# EAGLE design Autosense-combined (EAGLE 6.5.0)
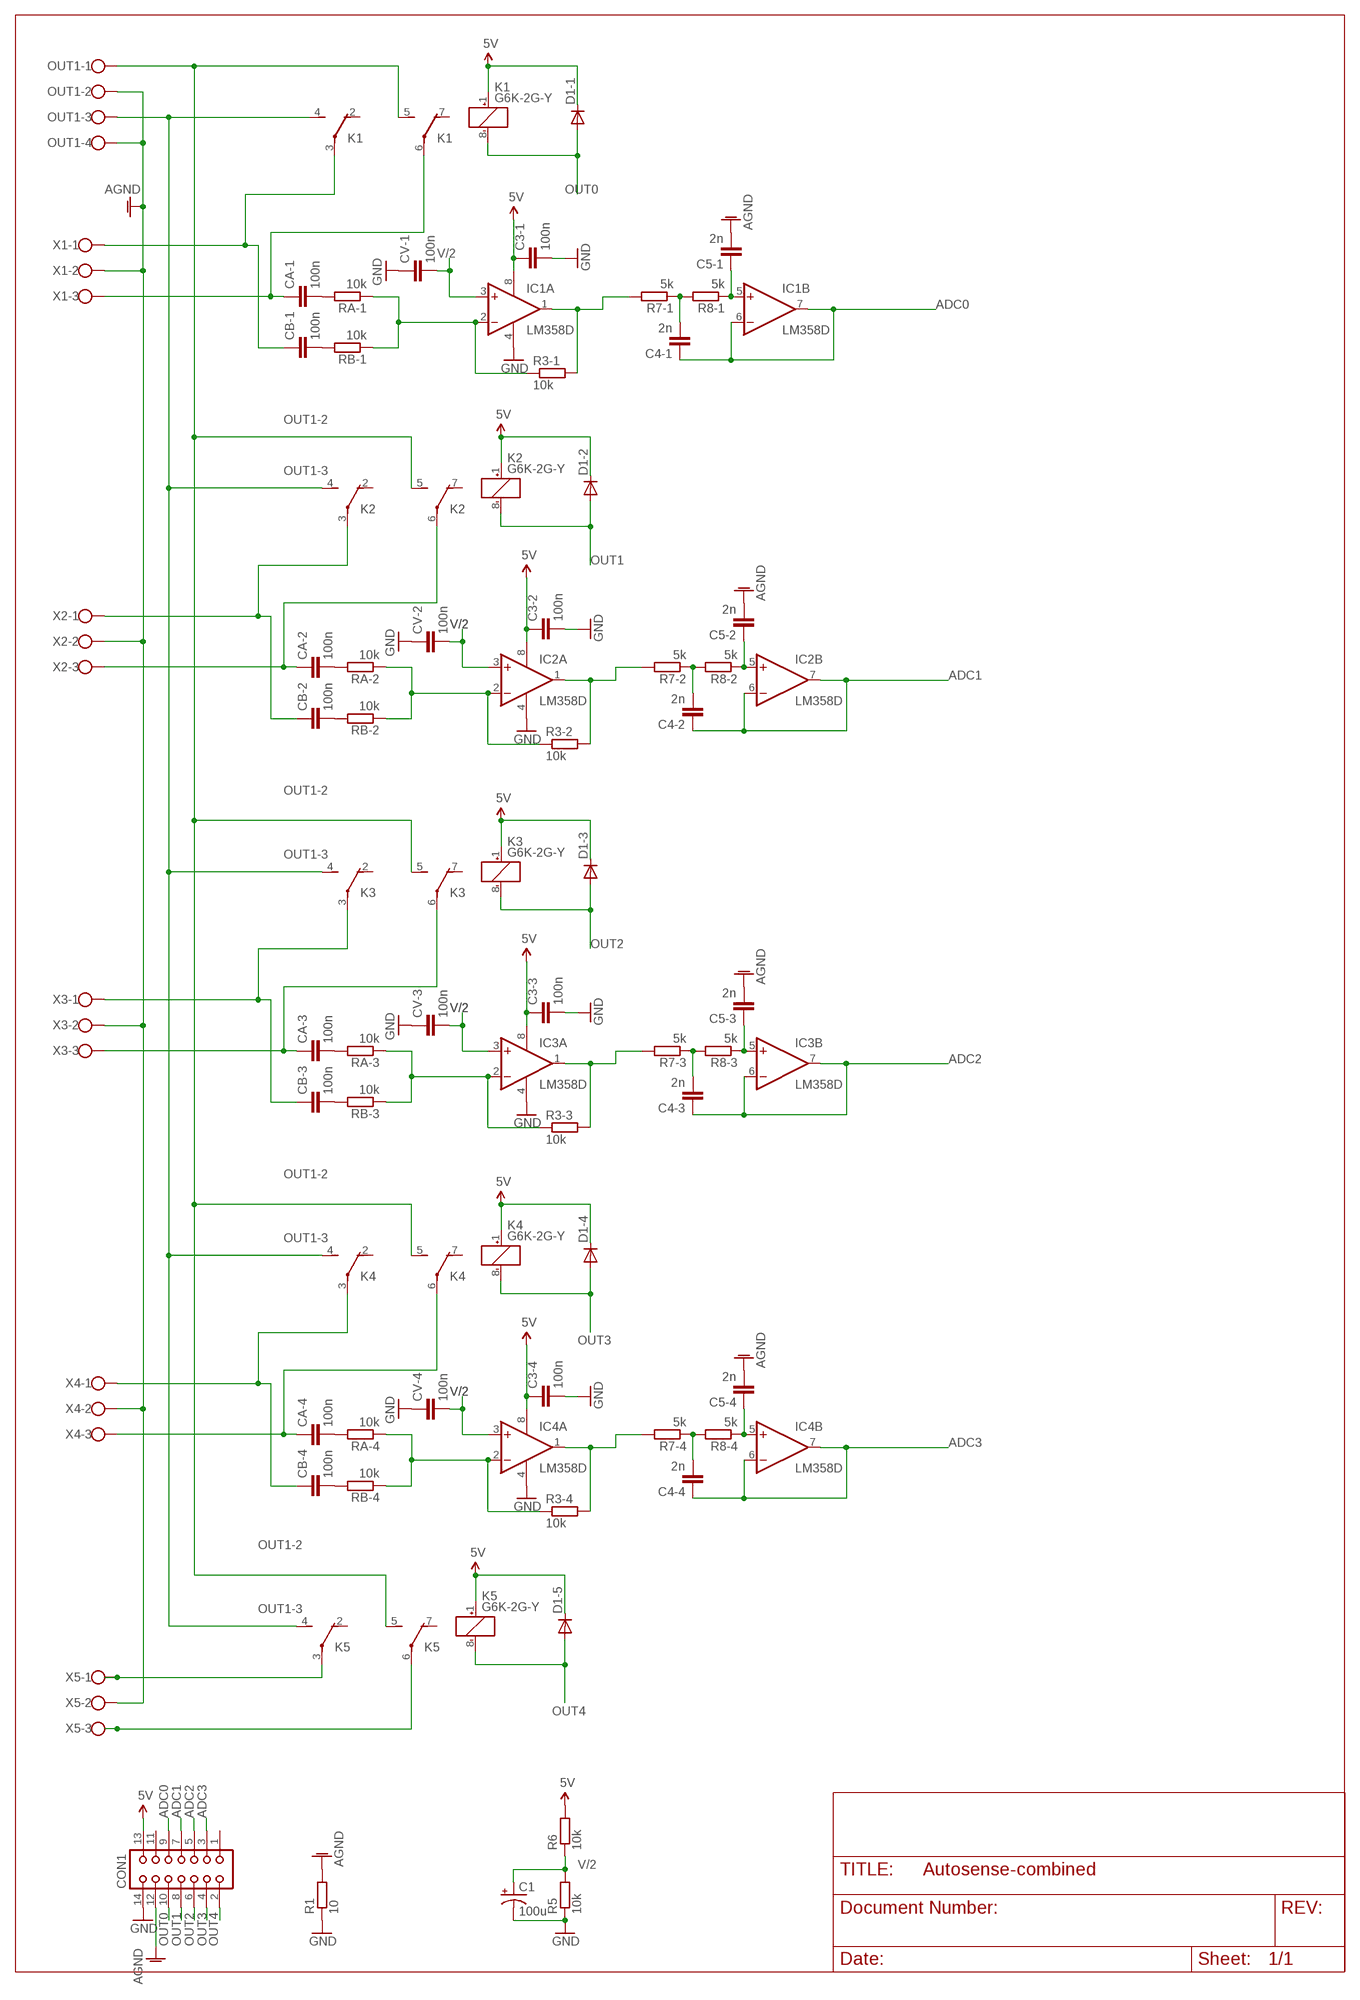
[diagram p0: schematic, sheet 1]

## Parts
C1  100u  CAP_POLPTH1  [CPOL-RADIAL-100UF-25V]
C3-1  100n  C-EUC0805  [C0805]
C3-2  100n  C-EUC0805  [C0805]
C3-3  100n  C-EUC0805  [C0805]
C3-4  100n  C-EUC0805  [C0805]
C4-1  2n  C-EUC0805  [C0805]
C4-2  2n  C-EUC0805  [C0805]
C4-3  2n  C-EUC0805  [C0805]
C4-4  2n  C-EUC0805  [C0805]
C5-1  2n  C-EUC0805  [C0805]
C5-2  2n  C-EUC0805  [C0805]
C5-3  2n  C-EUC0805  [C0805]
C5-4  2n  C-EUC0805  [C0805]
CA-1  100n  C-EUC0805  [C0805]
CA-2  100n  C-EUC0805  [C0805]
CA-3  100n  C-EUC0805  [C0805]
CA-4  100n  C-EUC0805  [C0805]
CB-1  100n  C-EUC0805  [C0805]
CB-2  100n  C-EUC0805  [C0805]
CB-3  100n  C-EUC0805  [C0805]
CB-4  100n  C-EUC0805  [C0805]
CON1  CON14L  [CON14L]
CV-1  100n  C-EUC0805  [C0805]
CV-2  100n  C-EUC0805  [C0805]
CV-3  100n  C-EUC0805  [C0805]
CV-4  100n  C-EUC0805  [C0805]
D1-1  DIODE-GF1  [GF1]
D1-2  DIODE-GF1  [GF1]
D1-3  DIODE-GF1  [GF1]
D1-4  DIODE-GF1  [GF1]
D1-5  DIODE-GF1  [GF1]
IC1  LM358D  [SO08]
IC2  LM358D  [SO08]
IC3  LM358D  [SO08]
IC4  LM358D  [SO08]
K1  G6K-2G-Y  [G6K-2G-Y]
K2  G6K-2G-Y  [G6K-2G-Y]
K3  G6K-2G-Y  [G6K-2G-Y]
K4  G6K-2G-Y  [G6K-2G-Y]
K5  G6K-2G-Y  [G6K-2G-Y]
OUT1  W237-4  [W237-4]
R1  10  R-EU_R1206  [R1206]
R3-1  10k  R-EU_R0805  [R0805]
R3-2  10k  R-EU_R0805  [R0805]
R3-3  10k  R-EU_R0805  [R0805]
R3-4  10k  R-EU_R0805  [R0805]
R5  10k  R-EU_R0805  [R0805]
R6  10k  R-EU_R0805  [R0805]
R7-1  5k  R-EU_R0805  [R0805]
R7-2  5k  R-EU_R0805  [R0805]
R7-3  5k  R-EU_R0805  [R0805]
R7-4  5k  R-EU_R0805  [R0805]
R8-1  5k  R-EU_R0805  [R0805]
R8-2  5k  R-EU_R0805  [R0805]
R8-3  5k  R-EU_R0805  [R0805]
R8-4  5k  R-EU_R0805  [R0805]
RA-1  10k  R-EU_R0805  [R0805]
RA-2  10k  R-EU_R0805  [R0805]
RA-3  10k  R-EU_R0805  [R0805]
RA-4  10k  R-EU_R0805  [R0805]
RB-1  10k  R-EU_M0805  [M0805]
RB-2  10k  R-EU_M0805  [M0805]
RB-3  10k  R-EU_M0805  [M0805]
RB-4  10k  R-EU_M0805  [M0805]
X1  W237-103  [W237-103]
X2  W237-103  [W237-103]
X3  W237-103  [W237-103]
X4  W237-103  [W237-103]
X5  W237-103  [W237-103]

## Nets
5V: C3-1.1 C3-2.1 C3-3.1 C3-4.1 CON1.13 D1-1.C D1-2.C D1-3.C D1-4.C D1-5.C IC1.8(P:V+) IC2.8(P:V+) IC3.8(P:V+) IC4.8(P:V+) K1.1(1:+) K2.1(1:+) K3.1(1:+) K4.1(1:+) K5.1(1:+) R6.2
$NET1: CB-2.1 K2.3(2:P) X2.1
$NET2: CB-3.1 K3.3(2:P) X3.1
$NET3: CB-4.1 K4.3(2:P) X4.1
$NET4: K5.3(2:P) X5.1
$NET13: CB-1.1 K1.3(2:P) X1.1
ADC0: C4-1.1 CON1.9 IC1.6(B:-IN) IC1.7(B:OUT)
ADC1: C4-2.1 CON1.7 IC2.6(B:-IN) IC2.7(B:OUT)
ADC2: C4-3.1 CON1.5 IC3.6(B:-IN) IC3.7(B:OUT)
ADC3: C4-4.1 CON1.3 IC4.6(B:-IN) IC4.7(B:OUT)
AGND: C5-1.2 C5-2.2 C5-3.2 C5-4.2 CON1.12 OUT1.2 OUT1.4 R1.2 X1.2 X2.2 X3.2 X4.2 X5.2
GND: C1.2(-) C3-1.2 C3-2.2 C3-3.2 C3-4.2 CON1.14 CV-1.1 CV-2.1 CV-3.1 CV-4.1 IC1.4(P:V-) IC2.4(P:V-) IC3.4(P:V-) IC4.4(P:V-) R1.1 R5.1
N$1: CA-1.1 K1.6(3:P) X1.3
N$2: C5-1.1 IC1.5(B:+IN) R8-1.1
N$3: IC3.1(A:OUT) R3-3.2 R7-3.2
N$4: IC3.2(A:-IN) R3-3.1 RA-3.1 RB-3.1
N$5: C5-3.1 IC3.5(B:+IN) R8-3.1
N$6: IC1.2(A:-IN) R3-1.1 RA-1.1 RB-1.1
N$7: IC2.1(A:OUT) R3-2.2 R7-2.2
N$8: C4-1.2 R7-1.1 R8-1.2
N$9: IC1.1(A:OUT) R3-1.2 R7-1.2
N$10: IC2.2(A:-IN) R3-2.1 RA-2.1 RB-2.1
N$11: CA-1.2 RA-1.2
N$12: C5-2.1 IC2.5(B:+IN) R8-2.1
N$13: CB-1.2 RB-1.2
N$14: C4-2.2 R7-2.1 R8-2.2
N$15: C4-3.2 R7-3.1 R8-3.2
N$16: CA-3.2 RA-3.2
N$17: CA-2.2 RA-2.2
N$18: CB-2.2 RB-2.2
N$19: CA-2.1 K2.6(3:P) X2.3
N$20: CB-3.2 RB-3.2
N$21: CA-3.1 K3.6(3:P) X3.3
N$22: IC4.1(A:OUT) R3-4.2 R7-4.2
N$23: IC4.2(A:-IN) R3-4.1 RA-4.1 RB-4.1
N$24: C5-4.1 IC4.5(B:+IN) R8-4.1
N$25: C4-4.2 R7-4.1 R8-4.2
N$26: CA-4.2 RA-4.2
N$27: CB-4.2 RB-4.2
N$28: CA-4.1 K4.6(3:P) X4.3
N$29: K5.6(3:P) X5.3
OUT0: CON1.10 D1-1.A K1.8(1:-)
OUT1: CON1.8 D1-2.A K2.8(1:-)
OUT1-2: K1.5(3:S) K2.5(3:S) K3.5(3:S) K4.5(3:S) K5.5(3:S) OUT1.1
OUT1-3: K1.4(2:S) K2.4(2:S) K3.4(2:S) K4.4(2:S) K5.4(2:S) OUT1.3
OUT2: CON1.6 D1-3.A K3.8(1:-)
OUT3: CON1.4 D1-4.A K4.8(1:-)
OUT4: CON1.2 D1-5.A K5.8(1:-)
V/2: C1.1(+) CV-1.2 CV-2.2 CV-3.2 CV-4.2 IC1.3(A:+IN) IC2.3(A:+IN) IC3.3(A:+IN) IC4.3(A:+IN) R5.2 R6.1
Unconnected: CON1.1 CON1.11 K1.2(2:O) K1.7(3:O) K2.2(2:O) K2.7(3:O) K3.2(2:O) K3.7(3:O) K4.2(2:O) K4.7(3:O) K5.2(2:O) K5.7(3:O)

## Library data of the parts
C1 = SparkFun:CAP_POL: Capacitor Polarized These are standard SMD and PTH capacitors. Normally 10uF, 47uF, and 100uF in electrolytic and tantalum varieties. Always verify the external diameter of the through hole cap, it varies with capacity, voltage, and manufacturer. The EIA devices should be standard.
C3-1-C3-4 C4-1-C4-4 C5-1-C5-4 CA-1-CA-4 CB-1-CB-4 CV-1-CV-4 = rcl:C-EU: CAPACITOR, European symbol
CON1 = con-harting-lars:CON14L: CONNECTOR; OC_FARNELL: unknown; OC_NEWARK: unknown
D1-1-D1-5 = diode:DIODE-: DIODE
IC1-IC4 = linear:LM358: OP AMP also LM158; LM258; LM2904 Source: http://cache.national.com/ds/LM/LM158.pdf
K1-K5 = relay:G6K: Low Signal Relay oeiwcsnts1.omron.com/.. D20G6K0100.pdf; OC_FARNELL: 4484794; OC_NEWARK: unknown
OUT1 = con-wago-500:W237-4: WAGO SCREW CLAMP; OC_FARNELL: unknown; OC_NEWARK: unknown
R1 RB-1-RB-4 = rcl:R-EU_: RESISTOR, European symbol
R3-1-R3-4 R5 R6 R7-1-R7-4 R8-1-R8-4 RA-1-RA-4 = resistor:R-EU_: RESISTOR, European symbol
X1-X5 = con-wago-500:W237-103: WAGO SCREW CLAMP; MPN: 237-103; OC_FARNELL: unknown; OC_NEWARK: 18M7116

## Board
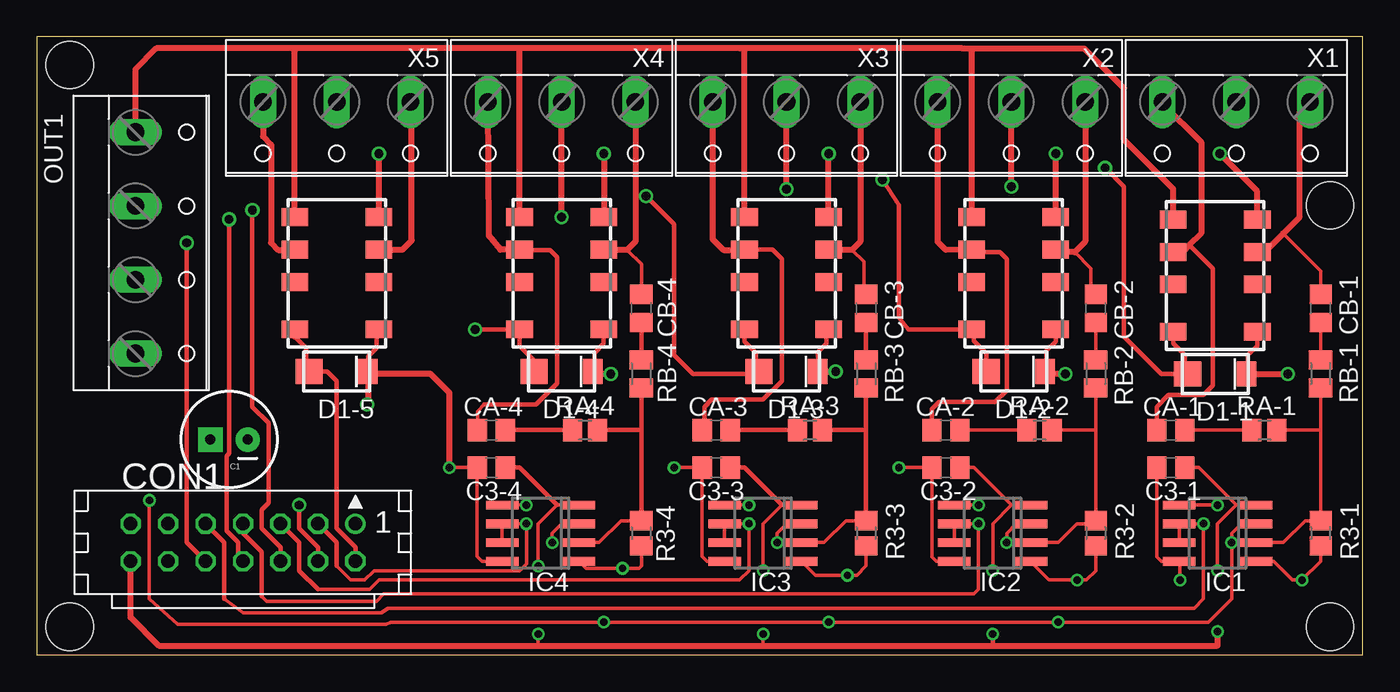
[diagram p1: board, top side]
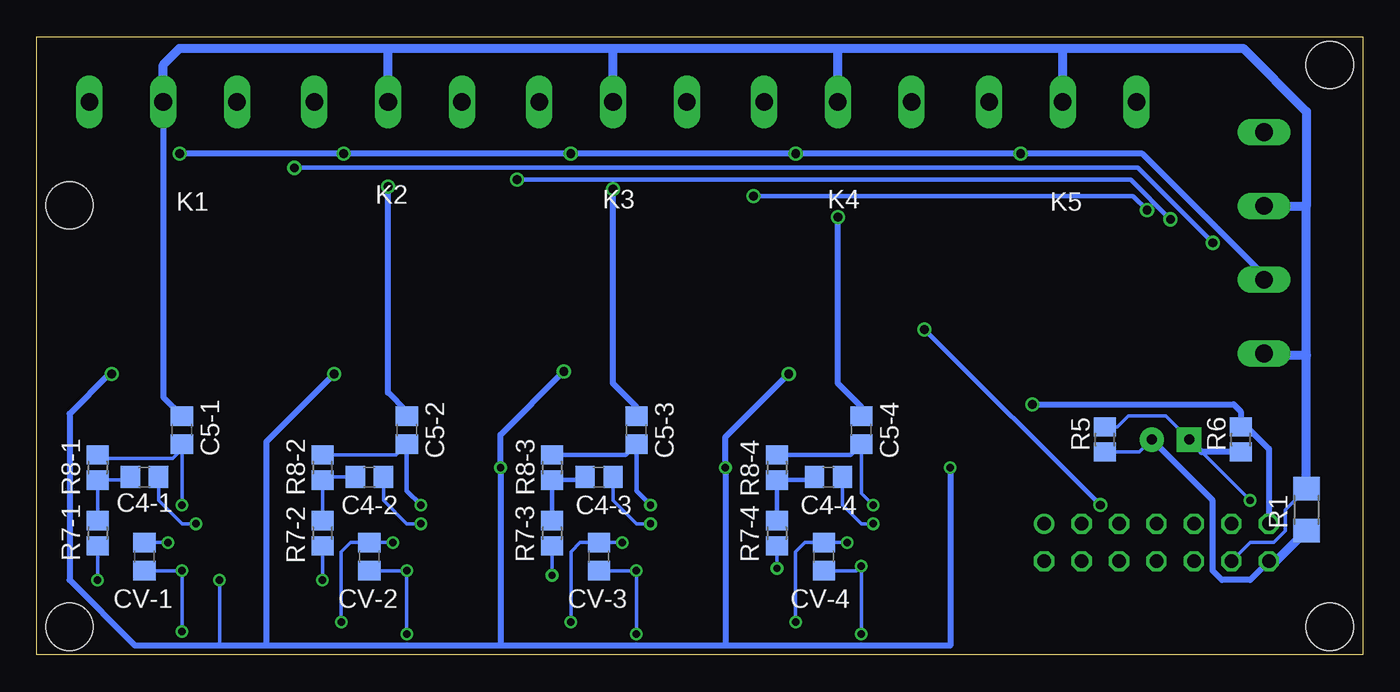
[diagram p2: board, bottom side, seen from below]

Size 89.84 x 41.9 mm. Coordinates in mm from the lower left corner, seen from the top.
Outline: 0,0 89.84,0 89.84,41.9 0,41.9 0,0
Copper layers (1*16): Top 0.0356mm / dielectric 1.5011mm / Bottom 0.0356mm
Design rules "LaenPCBOrder": minimum track width 6mil, minimum drill 13mil, track to track 6mil, track to pad 6mil, pad to pad 6mil, via to via 6mil, smd to smd 6mil, copper to edge 15mil, drill to drill 6mil, minimum pad ring 7mil, minimum via ring 7mil, stop-mask expansion 4mil, vias tented up to drill 0mil, thermal gap 10mil
Holes 3.2 mm at 87.63,30.48 2.22,1.91 87.63,1.91 2.22,40.01

### Footprints (pad centres in the part's own frame; a part is rotated, then mirrored left to right if it is on the bottom)
CPOL-RADIAL-100UF-25V = drill 0.7 pad 1.651 square: 1 1.27,0 | drill 0.7 pad 1.651: 2 -1.27,0
C0805 = smd 1.3 x 1.5: 1 -0.95,0; 2 0.95,0
CON14L = drill 0.914: 1 7.62,1.27 | drill 0.914 octagon: 2 7.62,-1.27; 3 5.08,1.27; 4 5.08,-1.27; 5 2.54,1.27; 6 2.54,-1.27; 7 0,1.27; 8 0,-1.27; 9 -2.54,1.27; 10 -2.54,-1.27; 11 -5.08,1.27; 12 -5.08,-1.27; 13 -7.62,1.27; 14 -7.62,-1.27
GF1 = smd 1.85 x 1.68: A 1.87,0 | smd 1.32 x 1.68: C -2.12,0
SO08 = smd 0.6 x 2.2: 1 -1.905,-2.6; 2 -0.635,-2.6; 3 0.635,-2.6; 4 1.905,-2.6; 5 1.905,2.6; 6 0.635,2.6; 7 -0.635,2.6; 8 -1.905,2.6
G6K-2G-Y = smd 1.2 x 1.8: 1 -3.8,-2.85; 2 -0.6,-2.85; 3 1.6,-2.85; 4 3.8,-2.85; 5 3.8,2.85; 6 1.6,2.85; 7 -0.6,2.85; 8 -3.8,2.85
W237-4 = drill 1.194 long: 1 -7.5,-1.27; 2 -2.5,-1.27; 3 2.5,-1.27; 4 7.5,-1.27
R1206 = smd 1.6 x 1.803: 1 -1.422,0; 2 1.422,0
R0805 = smd 1.3 x 1.5: 1 -0.85,0; 2 0.85,0
M0805 = smd 1.3 x 1.6: 1 -0.95,0; 2 0.95,0
W237-103 = drill 1.194 long: 1 -5,-1.29; 2 0,-1.29; 3 5,-1.29

### Placement (x,y rotation side)
C1  13.02,14.61 180 top
C3-1  76.83,12.7 0 top
C3-2  61.59,12.7 0 top
C3-3  46.04,12.7 0 top
C3-4  30.8,12.7 0 top
C4-1  82.55,12.06 180 bottom
C4-2  67.31,12.06 180 bottom
C4-3  51.75,12.06 180 bottom
C4-4  36.2,12.06 180 bottom
C5-1  80.01,15.24 90 bottom
C5-2  64.77,15.24 90 bottom
C5-3  49.21,15.24 90 bottom
C5-4  33.97,15.24 90 bottom
CA-1  76.83,15.24 0 top
CA-2  61.59,15.24 0 top
CA-3  46.04,15.24 0 top
CA-4  30.8,15.24 0 top
CB-1  87,23.5 270 top
CB-2  71.75,23.5 270 top
CB-3  56.2,23.5 270 top
CB-4  40.96,23.5 270 top
CON1  13.97,7.62 0 top
CV-1  82.55,6.67 90 bottom
CV-2  67.31,6.67 90 bottom
CV-3  51.75,6.67 90 bottom
CV-4  36.51,6.67 90 bottom
D1-1  79.85,19.05 180 top
D1-2  66.2,19.21 180 top
D1-3  50.8,19.21 180 top
D1-4  35.56,19.21 180 top
D1-5  20.32,19.21 180 top
IC1  80.01,8.26 90 top
IC2  64.77,8.26 90 top
IC3  49.21,8.26 90 top
IC4  34.13,8.26 90 top
K1  79.85,25.72 90 top
K2  66.2,25.88 90 top
K3  50.8,25.88 90 top
K4  35.56,25.88 90 top
K5  20.32,25.88 90 top
OUT1  7.94,27.94 270 top
R1  3.81,9.84 90 bottom
R3-1  87,8.26 270 top
R3-2  71.75,8.26 270 top
R3-3  56.2,8.26 270 top
R3-4  40.96,8.26 270 top
R5  17.46,14.61 90 bottom
R6  8.26,14.61 90 bottom
R7-1  85.72,8.26 270 bottom
R7-2  70.48,8.26 270 bottom
R7-3  54.93,8.26 270 bottom
R7-4  39.69,8.26 270 bottom
R8-1  85.72,12.7 270 bottom
R8-2  70.48,12.7 270 bottom
R8-3  54.93,12.7 270 bottom
R8-4  39.69,12.7 270 bottom
RA-1  83.19,15.24 180 top
RA-2  67.94,15.24 180 top
RA-3  52.39,15.24 180 top
RA-4  37.15,15.24 180 top
RB-1  87,19.05 90 top
RB-2  71.75,19.05 90 top
RB-3  56.2,19.05 90 top
RB-4  40.96,19.05 90 top
X1  81.28,36.2 180 top
X2  66.04,36.2 180 top
X3  50.8,36.2 180 top
X4  35.56,36.2 180 top
X5  20.32,36.2 180 top

### Tracks (layer width: path | path; a pad name or v marks a point on that pad's centre or on a via)
5V  (via drill 0.5, 0.6)
  Top 0.254: v77.47,5.08 77.47,6.29 IC1.8 76.2,6.35 75.89,6.67 C3-1.1 | C3-3.1 45.09,6.67 45.4,6.35 IC3.8 | C3-4.1 29.84,6.67 30.16,6.35 IC4.8 | C3-3.1 v43.18,12.7 | v58.42,12.7 C3-2.1 60.65,6.67 60.96,6.35 IC2.8 | C3-4.1 v27.94,12.7
  Top 0.305: C3-3.1 | C3-4.1 | K1.1 82.7,20.95 82.07,20.32 82.07,19.15 D1-1.C | K2.1 69.05,21.27 68.42,20.64 68.42,19.31 D1-2.C | D1-3.C 52.92,20.54 53.5,21.11 53.5,21.93 K3.1 | K4.1 38.41,21.11 37.78,20.48 37.78,19.31 D1-4.C | D1-5.C 22.44,20.22 23.02,20.8 23.02,21.93
  Top 0.406: v27.94,12.7 27.94,17.78 26.67,19.05 22.6,19.05 D1-5.C 22.44,17.04 v22.38,16.99 | D1-1.C v84.77,19.05 | 23.02,21.93 K5.1 | v38.89,19.05 37.84,19.05 D1-4.C | D1-3.C v54.13,19.21 | 68.38,19.15 D1-2.C 68.48,19.05 v69.69,19.05
  Bottom 0.254: v77.47,5.08 77.47,0.64
  Bottom 0.406: 43.18,0.64 27.94,0.64 v27.94,12.7 | 43.18,0.64 58.42,0.64 | 58.42,0.64 74.3,0.64 | 74.3,0.64 77.47,0.64 83.19,0.64 87.63,5.08 87.63,16.35 84.93,19.05 v84.77,19.05 | 74.3,0.64 74.3,14.45 v69.69,19.05 | 58.42,0.64 v58.42,12.7 58.42,14.92 v54.13,19.21 | 43.18,0.64 v43.18,12.7 43.18,14.76 v38.89,19.05 | CON1.13 6.35,13.97 7.83,15.46 R6.2 8.26,16.51 8.73,16.99 v22.38,16.99
$NET1
  Top 0.254: CB-2.1 71.44,24.77 71.44,26.2 70.33,27.3
  Top 0.406: X2.1 71.04,28.02 70.33,27.3 68.58,27.3 K2.3
$NET2
  Top 0.254: CB-3.1 56.05,24.45 56.05,26.66 55.24,27.46
  Top 0.406: X3.1 55.8,28.02 55.24,27.46 53.66,27.46 K3.3
$NET3
  Top 0.254: CB-4.1 40.96,26.51 40.01,27.46
  Top 0.406: X4.1 40.56,28.02 40.01,27.46 38.26,27.46 K4.3
$NET4
  Top 0.406: K5.3 24.78,27.48 25.4,28.1 25.4,37.41 X5.1
$NET13
  Top 0.254: CB-1.1 87,26.04 84.45,28.57
  Top 0.406: X1.1 85.57,36.77 85.57,29.69 84.45,28.57 83.2,27.32 K1.3
  Bottom 0.254: X1.1 86.28,37.38
ADC0  (via drill 0.5)
  Top 0.254: 12.7,3.81 13.97,2.86 23.34,2.86 23.81,3.17 78.42,3.17 79.06,3.81 v79.06,8.89 IC1.6 IC1.7
  Top 0.305: 12.7,3.81 12.7,7.62 CON1.9
  Bottom 0.254: C4-1.1 81.6,10.48 80.01,8.89 v79.06,8.89
ADC1  (via drill 0.5)
  Top 0.254: 15.24,3.97 15.56,3.65 23.02,3.65 23.5,4.13 63.5,4.13 63.82,4.45 v63.82,8.89 IC2.6 IC2.7
  Top 0.305: CON1.7 13.97,8.26 15.24,6.99 15.24,3.97
  Bottom 0.254: C4-2.1 66.36,10.48 64.77,8.89 v63.82,8.89
ADC2  (via drill 0.5)
  Top 0.254: 19.05,4.45 22.54,4.45 23.18,5.08 47.62,5.08 48.26,5.71 v48.26,8.89 IC3.6 IC3.7
  Top 0.305: 19.05,4.45 17.78,5.71 17.78,7.62 CON1.5
  Bottom 0.254: 50.8,11.43 50.8,10.48 49.21,8.89 v48.26,8.89
  Bottom 0.305: C4-3.1 50.8,11.43
ADC3  (via drill 0.5)
  Top 0.254: 20.32,6.03 21.27,5.08 22.23,5.08 22.86,5.71 32.7,5.71 33.18,6.19 v33.18,8.89 IC4.6 IC4.7
  Top 0.305: 20.32,6.03 20.32,7.62 CON1.3
  Bottom 0.254: C4-4.1 35.24,10.16 33.97,8.89 v33.18,8.89
AGND  (via drill 0.6)
  Top 0.406: v66.04,31.75 X2.2 | v50.8,31.59 X3.2 | v35.56,29.69 X4.2
  Bottom 0.254: CON1.12 7.62,7.62 6.03,7.62 5.24,8.41 5.24,9.84 R1.2 | C5-4.2 34.29,16.51
  Bottom 0.406: C5-2.2 64.77,16.51 66.04,17.78 v66.04,31.75 | v35.56,29.69 35.56,18.41 33.97,16.83 C5-4.2 | X1.2 81.28,17.46 C5-1.2 | C5-3.2 49.21,16.83 50.8,18.41 v50.8,31.59
  Bottom 0.61: X1.2 81.28,40.01 80.17,41.12 66.04,41.12 | X2.2 66.04,41.12 | 3.81,30.48 3.81,36.83 8.1,41.12 20.32,41.12 | OUT1.4 6.55,20.32 3.81,20.32 | OUT1.2 3.85,30.44 3.81,30.48 | 66.04,41.12 50.8,41.12 | 50.8,41.12 35.56,41.12 | 35.56,41.12 20.32,41.12 | X4.2 35.56,41.12 | X3.2 50.8,41.12 | R1.2 3.81,20.32 | 3.81,20.32 3.81,30.48 | X5.2 20.32,41.12
GND  (via drill 0.5)
  Top 0.254: 81.28,10.16 78.74,12.7 C3-1.2 | 81.28,10.16 80.01,8.89 v80.01,5.71 | C3-2.2 63.5,12.7 66.04,10.16 | 66.04,10.16 64.77,8.89 v64.77,5.71 | v49.21,5.71 49.21,8.89 50.48,10.16 IC3.4 | v49.21,1.43 49.21,0.64 | v33.97,6.03 33.97,8.89 35.24,10.16 IC4.4 | 33.97,0.64 v33.97,1.43 | IC1.4 81.28,10.16 | IC2.4 66.04,10.16
  Top 0.305: v64.77,1.43 64.77,0.64 | C3-3.2 47.94,12.7 50.48,10.16 | C3-4.2 32.7,12.7 35.24,10.16
  Top 0.406: CON1.14 6.35,2.54 8.26,0.64 33.97,0.64 49.21,0.64 64.77,0.64 80.01,0.64 v80.01,1.59
  Bottom 0.254: v80.01,1.59 v80.01,5.71 81.91,5.71 CV-1.1 | v64.77,1.43 v64.77,5.71 CV-2.1 | v49.21,1.43 v49.21,5.71 CV-3.1 | v33.97,1.43 v33.97,6.03 34.29,5.72 CV-4.1 | R5.1 15.14,13.76 C1.2
  Bottom 0.406: CON1.14 7.62,5.08 9.53,5.08 10.16,5.71 10.16,10.48 C1.2
  Bottom 0.61: CON1.14 5.88,6.35 R1.1
N$1  (via drill 0.6)
  Top 0.305: CA-1.1 75.88,16.83 76.68,17.62 79.06,17.62 79.69,18.26 79.69,26.19 78.11,27.78
  Top 0.406: v76.28,37.38 78.9,34.77 78.9,28.57 78.11,27.78 77.64,27.32 K1.6
  Bottom 0.254: X1.3 v76.28,37.38
N$2  (via drill 0.5)
  Top 0.254: v80.01,10.16 IC1.5
  Bottom 0.254: R8-1.1 85.51,13.34 80.64,13.34 80.01,13.97 C5-1.1 80.01,10.79 v80.01,10.16
N$3  (via drill 0.5)
  Top 0.254: R3-3.2 56.2,6.03 55.56,5.4 v54.93,5.4 52.77,5.4 IC3.1
  Bottom 0.254: R7-3.2 v54.93,5.4
N$4
  Top 0.254: R3-3.1 54.83,9.11 53.34,7.62 IC3.2
  Top 0.305: R3-3.1 56.2,15.24 | 56.2,15.24 RB-3.1 | RA-3.1 56.2,15.24
N$5  (via drill 0.5)
  Top 0.254: v48.26,10.16 IC3.5
  Bottom 0.305: R8-3.1 49.95,13.55 C5-3.1 49.21,11.11 v48.26,10.16
N$6
  Top 0.254: RB-1.1 87,15.24 | 87,15.24 R3-1.1 85.94,9.11 84.45,7.62 IC1.2 | RA-1.1 87,15.24
N$7  (via drill 0.5)
  Top 0.254: R3-2.2 71.75,5.71 71.12,5.08 v70.48,5.08 68.58,5.08 67.31,6.35 IC2.1
  Bottom 0.254: R7-2.2 v70.48,5.08
N$8
  Bottom 0.254: C4-1.2 83.72,11.85 R8-1.2 R7-1.1
N$9  (via drill 0.5)
  Top 0.254: R3-1.2 87,6.35 v85.72,5.08 85.09,5.08 83.82,6.35 IC1.1
  Bottom 0.254: R7-1.2 v85.72,5.08
N$10
  Top 0.254: RB-2.1 71.75,15.24 | 71.75,15.24 R3-2.1 71.54,8.89 70.48,8.89 69.22,7.62 IC2.2 | RA-2.1 71.75,15.24
N$11
  Top 0.254: RA-1.2 CA-1.2
N$12  (via drill 0.5)
  Top 0.254: IC2.5 v63.82,10.16
  Bottom 0.254: R8-2.1 65.51,13.55 C5-2.1 64.61,14.45
  Bottom 0.305: C5-2.1 64.77,11.11 v63.82,10.16
N$13
  Top 0.254: CB-1.2 RB-1.2
N$14
  Bottom 0.254: C4-2.2 70.27,12.06 | R8-2.2 R7-2.1
  Bottom 0.305: 70.27,12.06 R8-2.2
N$15
  Bottom 0.305: R7-3.1 R8-3.2 52.92,11.85 C4-3.2
N$16
  Top 0.305: RA-3.2 CA-3.2
N$17
  Top 0.254: CA-2.2 RA-2.2
N$18
  Top 0.254: CB-2.2 RB-2.2
N$19
  Top 0.305: CA-2.1 60.65,16.67 61.12,17.14 64.93,17.14 65.72,17.94 65.72,26.83 65.25,27.3 62.88,27.3 K2.6
  Top 0.406: K2.6 61.59,27.46 61.04,28.02 X2.3
N$20
  Top 0.305: CB-3.2 RB-3.2
N$21
  Top 0.305: K3.6 49.84,27.48 50.48,26.83 50.48,18.57 49.21,17.3 45.72,17.3 45.24,16.83 45.24,15.4 CA-3.1
  Top 0.406: X3.3 45.8,28.18 46.51,27.46 47.94,27.46 K3.6
N$22  (via drill 0.5)
  Top 0.254: R3-4.2 40.96,6.03 40.8,5.87 v39.69,5.87 37.21,5.87 IC4.1
  Bottom 0.254: R7-4.2 v39.69,5.87
N$23
  Top 0.254: R3-4.1 39.59,9.11 38.1,7.62 IC4.2
  Top 0.305: R3-4.1 40.96,15.24 | 40.96,15.24 RB-4.1 | RA-4.1 40.96,15.24
N$24  (via drill 0.5)
  Top 0.254: v33.18,10.16 IC4.5
  Bottom 0.254: v33.18,10.16 33.97,10.95 C5-4.1
  Bottom 0.305: R8-4.1 34.71,13.55 C5-4.1
N$25
  Bottom 0.305: R7-4.1 R8-4.2 37.36,11.85 C4-4.2
N$26
  Top 0.305: RA-4.2 CA-4.2
N$27
  Top 0.305: CB-4.2 RB-4.2
N$28
  Top 0.254: CA-4.1 29.85,16.51 30.32,16.99
  Top 0.305: 30.32,16.99 33.81,16.99 35.24,18.41 35.24,26.99 34.77,27.46 32.72,27.46 K4.6
  Top 0.406: K4.6 31.42,27.48 30.64,28.42 30.64,28.67 X4.3
N$29
  Top 0.406: X5.3 15.32,35.16 15.88,34.61 15.88,27.94 16.35,27.46 17.46,27.46 K5.6
OUT0  (via drill 0.6)
  Top 0.305: v10.16,27.94 10.16,7.62 CON1.10 | v72.39,33.02 73.66,31.75 73.66,21.59 76.2,19.05 D1-1.A 77.79,19.24 77.79,20.32 77,21.11 K1.8
  Bottom 0.305: v72.39,33.02 15.24,33.02 v10.16,27.94
OUT1  (via drill 0.6)
  Top 0.305: v57.31,32.23 58.42,30.48 58.42,22.86 59.05,22.07 K2.8 63.5,21.93 63.5,21.27 64.33,20.44 D1-2.A | CON1.8 13.65,6.67 13.65,7.62 12.86,8.41 12.86,13.49 13.02,13.65 v13.02,29.53
  Bottom 0.305: v57.31,32.23 15.72,32.23 v13.02,29.53
OUT1-2
  Top 0.406: K1.5 77,31.58 73.66,34.92 73.66,38.42 70.96,41.12 63.5,41.12 | 62.71,41.12 47.62,41.12 | 47.62,41.12 32.7,41.12 | 32.7,41.12 17.3,41.12 | 17.3,41.12 8.1,41.12 6.67,39.69 OUT1.1 | K5.5 17.47,40.95 17.3,41.12 | 63.35,41.11 62.71,41.12 | 62.71,41.12 63.5,41.12 | K2.5 63.35,40.97 63.5,41.12 | K3.5 47.95,41.11 47.62,41.12 | K4.5 32.7,41.12
OUT1-3  (via drill 0.6)
  Top 0.305: 53.65,33.66 v53.66,33.97
  Top 0.406: K1.4 82.7,31.44 v80.17,33.97 | K2.4 69.05,33.66 v69.06,33.97 | K3.4 53.65,33.66 | v38.42,33.97 38.42,29.84 K4.4 | K5.4 v23.18,33.97
  Bottom 0.406: OUT1.3 6.67,25.72 14.92,33.97 v23.18,33.97 v38.42,33.97 v53.66,33.97 v69.06,33.97 v80.17,33.97
OUT2  (via drill 0.6)
  Top 0.305: v41.27,31.11 43.18,29.21 43.18,20.32 44.45,19.05 48.77,19.05 D1-3.A 48.74,19.4 48.74,20.48 47.95,21.27 K3.8 | v14.61,30.16 14.61,16.83 15.72,15.72 15.72,10.32 15.24,9.84 15.24,8.57 16.51,7.3 CON1.6
  Bottom 0.305: v41.27,31.11 15.56,31.11 v14.61,30.16
OUT3  (via drill 0.6)
  Top 0.305: v17.78,10.16 17.78,8.57 19.05,7.3 CON1.4 | D1-4.A 33.69,19.97 32.7,20.95 32.7,22.07 K4.8 32.7,22.07 v29.69,22.07
  Bottom 0.305: v29.69,22.07 v17.78,10.16
OUT4
  Top 0.305: 17.47,21.58 18.26,20.8 18.26,19.4 | CON1.2 21.59,7.3 20.32,8.57 20.32,18.57 19.68,19.21 D1-5.A
  Top 0.406: K5.8 17.47,21.58 | 18.26,19.4 D1-5.A
V/2  (via drill 0.5)
  Top 0.254: v7.62,10.48 7.62,3.81 9.53,2.06 23.65,2.06 23.97,2.22 v38.42,2.22 v53.66,2.22 v69.22,2.22 79.38,2.22 80.96,3.81 v80.96,7.62 80.96,8.26 81.92,9.21 IC1.3 | 66.36,8.89 65.72,8.26 v65.72,7.62 | v50.16,7.62 50.16,8.26 50.8,8.89 IC3.3 | v34.92,7.62 34.92,8.26 35.56,8.89 IC4.3
  Top 0.406: 66.36,8.89 IC2.3
  Bottom 0.254: v7.62,10.48 C1.1 13.34,16.19 15.88,16.19 16.61,15.46 R5.2 | CV-1.2 v80.97,7.62 v80.96,7.62 | v65.72,7.62 CV-2.2 68.58,7.62 69.22,6.99 v69.22,2.22 | CV-3.2 v50.17,7.62 v50.16,7.62 53.02,7.62 53.66,6.99 v53.66,2.22 | v38.42,2.22 38.42,6.99 37.78,7.62 CV-4.2 v34.93,7.62 v34.92,7.62
  Bottom 0.406: R6.1 10.9,13.76 C1.1

### Text on the board
tValues: Autosense v2